# EAGLE design in-out_board (EAGLE 9.2.2)
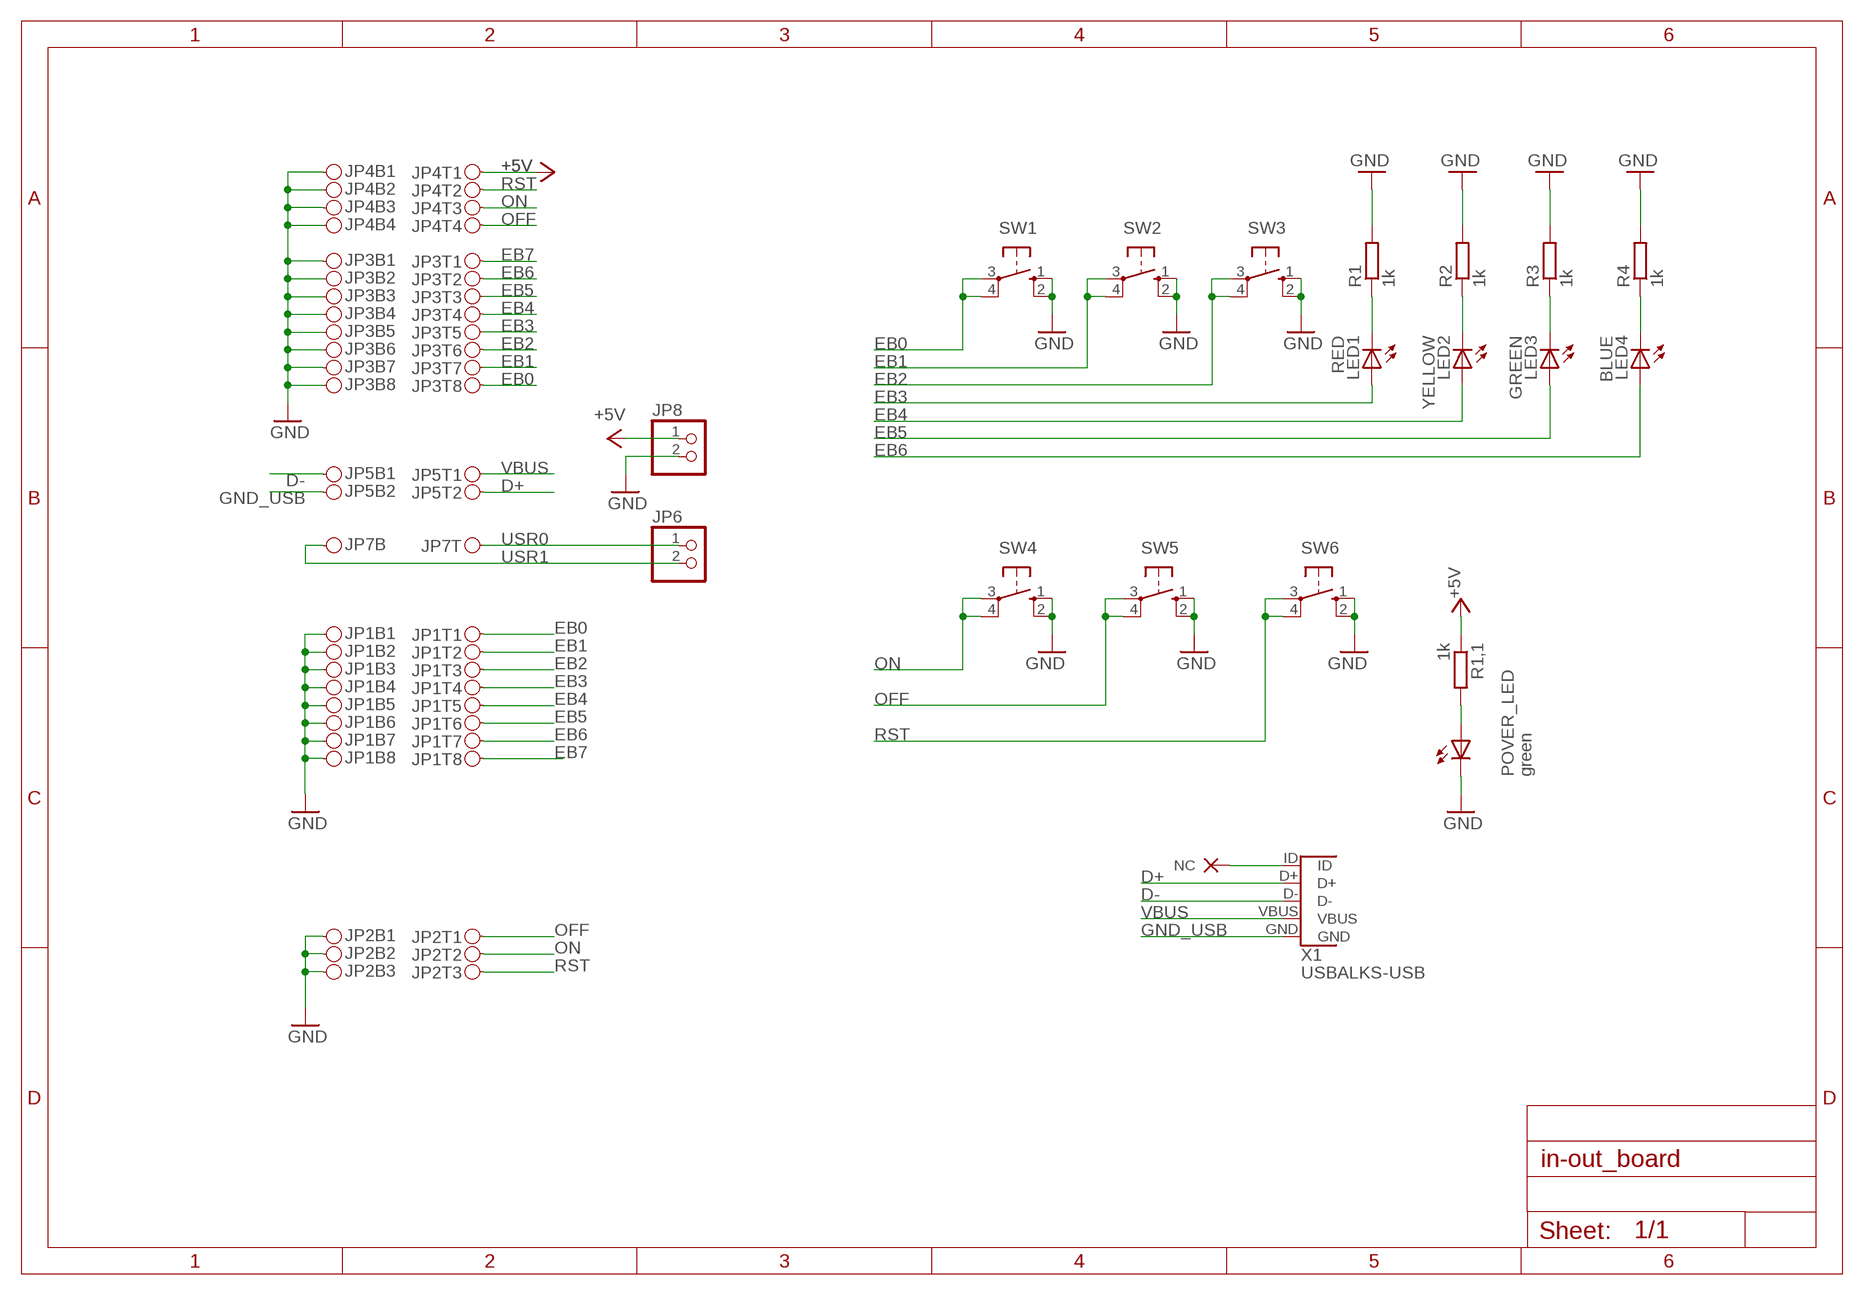
[diagram p0: schematic, sheet 1]

## Parts
JP1  PINH2X08  [PINH2X08SMD]
JP2  PINH2X03  [PINH2X03SMD]
JP3  PINH2X08  [PINH2X08SMD]
JP4  PINH2X04  [PINH2X04SMD]
JP5  PINH2X02  [PINH2X02SMD]
JP6  PINHD-1X2  [1X02]
JP7  PINH2X01  [PINH2X01SMD]
JP8  PINHD-1X2  [1X02]
LED1  RED  LED5MM  [LED5MM]
LED2  YELLOW  LED5MM  [LED5MM]
LED3  GREEN  LED5MM  [LED5MM]
LED4  BLUE  LED5MM  [LED5MM]
NC1  NC  (no package)
POVER_LED  green  LED5MM  [LED5MM]
R1  1k  R-EU_0204/2V  [0204V]
R1,1  1k  R-EU_0204/2V  [0204V]
R2  1k  R-EU_0204/2V  [0204V]
R3  1k  R-EU_0204/2V  [0204V]
R4  1k  R-EU_0204/2V  [0204V]
SW1  10-XX  [B3F-10XX]
SW2  10-XX  [B3F-10XX]
SW3  10-XX  [B3F-10XX]
SW4  10-XX  [B3F-10XX]
SW5  10-XX  [B3F-10XX]
SW6  10-XX  [B3F-10XX]
X1  USBALKS-USB  [ALKS-USB]

## Nets
+5V: JP4.T1 JP8.1 R1,1.1
D+: JP5.T2 X1.D+
D-: JP5.B1 X1.D-
EB0: JP1.T1 JP3.T8 SW1.3(P) SW1.4(P1)
EB1: JP1.T2 JP3.T7 SW2.3(P) SW2.4(P1)
EB2: JP1.T3 JP3.T6 SW3.3(P) SW3.4(P1)
EB3: JP1.T4 JP3.T5 LED1.A
EB4: JP1.T5 JP3.T4 LED2.A
EB5: JP1.T6 JP3.T3 LED3.A
EB6: JP1.T7 JP3.T2 LED4.A
EB7: JP1.T8 JP3.T1
GND: JP1.B1 JP1.B2 JP1.B3 JP1.B4 JP1.B5 JP1.B6 JP1.B7 JP1.B8 JP2.B1 JP2.B2 JP2.B3 JP3.B1 JP3.B2 JP3.B3 JP3.B4 JP3.B5 JP3.B6 JP3.B7 JP3.B8 JP4.B1 JP4.B2 JP4.B3 JP4.B4 JP8.2 POVER_LED.K(C) R1.2 R2.2 R3.2 R4.2 SW1.1(S) SW1.2(S1) SW2.1(S) SW2.2(S1) SW3.1(S) SW3.2(S1) SW4.1(S) SW4.2(S1) SW5.1(S) SW5.2(S1) SW6.1(S) SW6.2(S1)
GND_USB: JP5.B2 X1.GND
LED1: LED1.K(C) R1.1
LED2: LED2.K(C) R2.1
LED3: LED3.K(C) R3.1
LED4: LED4.K(C) R4.1
OFF: JP2.T1 JP4.T4 SW5.3(P) SW5.4(P1)
ON: JP2.T2 JP4.T3 SW4.3(P) SW4.4(P1)
PWRLED: POVER_LED.A R1,1.2
RST: JP2.T3 JP4.T2 SW6.3(P) SW6.4(P1)
USR0: JP6.1 JP7.T1
USR1: JP6.2 JP7.B1
VBUS: JP5.T1 X1.VBUS
X1ID: NC1.NC X1.ID

## Library data of the parts
JP1 JP3 = pinhead_smd:PINH2X08
JP2 = pinhead_smd:PINH2X03
JP4 = pinhead_smd:PINH2X04
JP5 = pinhead_smd:PINH2X02
JP6 JP8 = pinhead:PINHD-1X2: PIN HEADER
JP7 = pinhead_smd:PINH2X01
LED1-LED4 POVER_LED = led:LED: LED OSRAM: - CHIPLED LG R971, LG N971, LY N971, LG Q971, LY Q971, LO R971, LY R971 LH N974, LH R974 LS Q976, LO Q976, LY Q976 LO Q996 - Hyper CHIPLED LW Q18S LB Q993, LB Q99A, LB R99A - SideLED LS A670, LO A670, LY A670, LG A670, LP A670 LB A673, LV A673, LT A673, LW A673 LH A674 LY A675 LS A676, LA A676, LO A676, LY A676, LW A676 LS A679, LY A679, LG A679 - Hyper Micro SIDELED® LS Y876, LA Y876, LO Y876, LY Y876 LT Y87S - SmartLED LW L88C, LW L88S LB L89C, LB L89S, LG L890 LS L89K, LO L89K, LY L89K LS L896, LA L896, LO L896, LY L896 - TOPLED LS T670, LO T670, LY T670, LG T670, LP T670 LSG T670, LSP T670, LSY T670, LOP T670, LYG T670 LG T671, LOG T671, LSG T671 LB T673, LV T673, LT T673, LW T673 LH T674 LS T676, LA T676, LO T676, LY T676, LB T676, LH T676, LSB T676, LW T676 LB T67C, LV T67C, LT T67C, LS T67K, LO T67K, LY T67K, LW E67C LS E67B, LA E67B, LO E67B, LY E67B, LB E67C, LV E67C, LT E67C LW T67C LS T679, LY T679, LG T679 LS T770, LO T770, LY T770, LG T770, LP T770 LB T773, LV T773, LT T773, LW T773 LH T774 LS E675, LA E675, LY E675, LS T675 LS T776, LA T776, LO T776, LY T776, LB T776 LHGB T686 LT T68C, LB T68C - Hyper Mini TOPLED® LB M676 - Mini TOPLED Santana® LG M470 LS M47K, LO M47K, LY M47K Source: http://www.osram.convergy.de LUXEON: - LUMILED® LXK2-PW12-R00, LXK2-PW12-S00, LXK2-PW14-U00, LXK2-PW14-V00 LXK2-PM12-R00, LXK2-PM12-S00, LXK2-PM14-U00 LXK2-PE12-Q00, LXK2-PE12-R00, LXK2-PE12-S00, LXK2-PE14-T00, LXK2-PE14-U00 LXK2-PB12-K00, LXK2-PB12-L00, LXK2-PB12-M00, LXK2-PB14-N00, LXK2-PB14-P00, LXK2-PB14-Q00 LXK2-PR12-L00, LXK2-PR12-M00, LXK2-PR14-Q00, LXK2-PR14-R00 LXK2-PD12-Q00, LXK2-PD12-R00, LXK2-PD12-S00 LXK2-PH12-R00, LXK2-PH12-S00 LXK2-PL12-P00, LXK2-PL12-Q00, LXK2-PL12-R00 Source: www.luxeon.com KINGBRIGHT: KA-3528ASYC Source: www.kingbright.com
NC1 = NC:NC: _EXTERNAL_
R1 R1,1 R2-R4 = resistor:R-EU_: RESISTOR, European symbol
SW1-SW6 = switch-omron:10-XX: OMRON SWITCH; MPN: B3F-1000; OC_FARNELL: 176432; OC_NEWARK: 36M3542
X1 = usb:USB

## Net classes
0 default: width 0.2 mm, drill 0.35 mm, clearance 0.2 mm

## Board
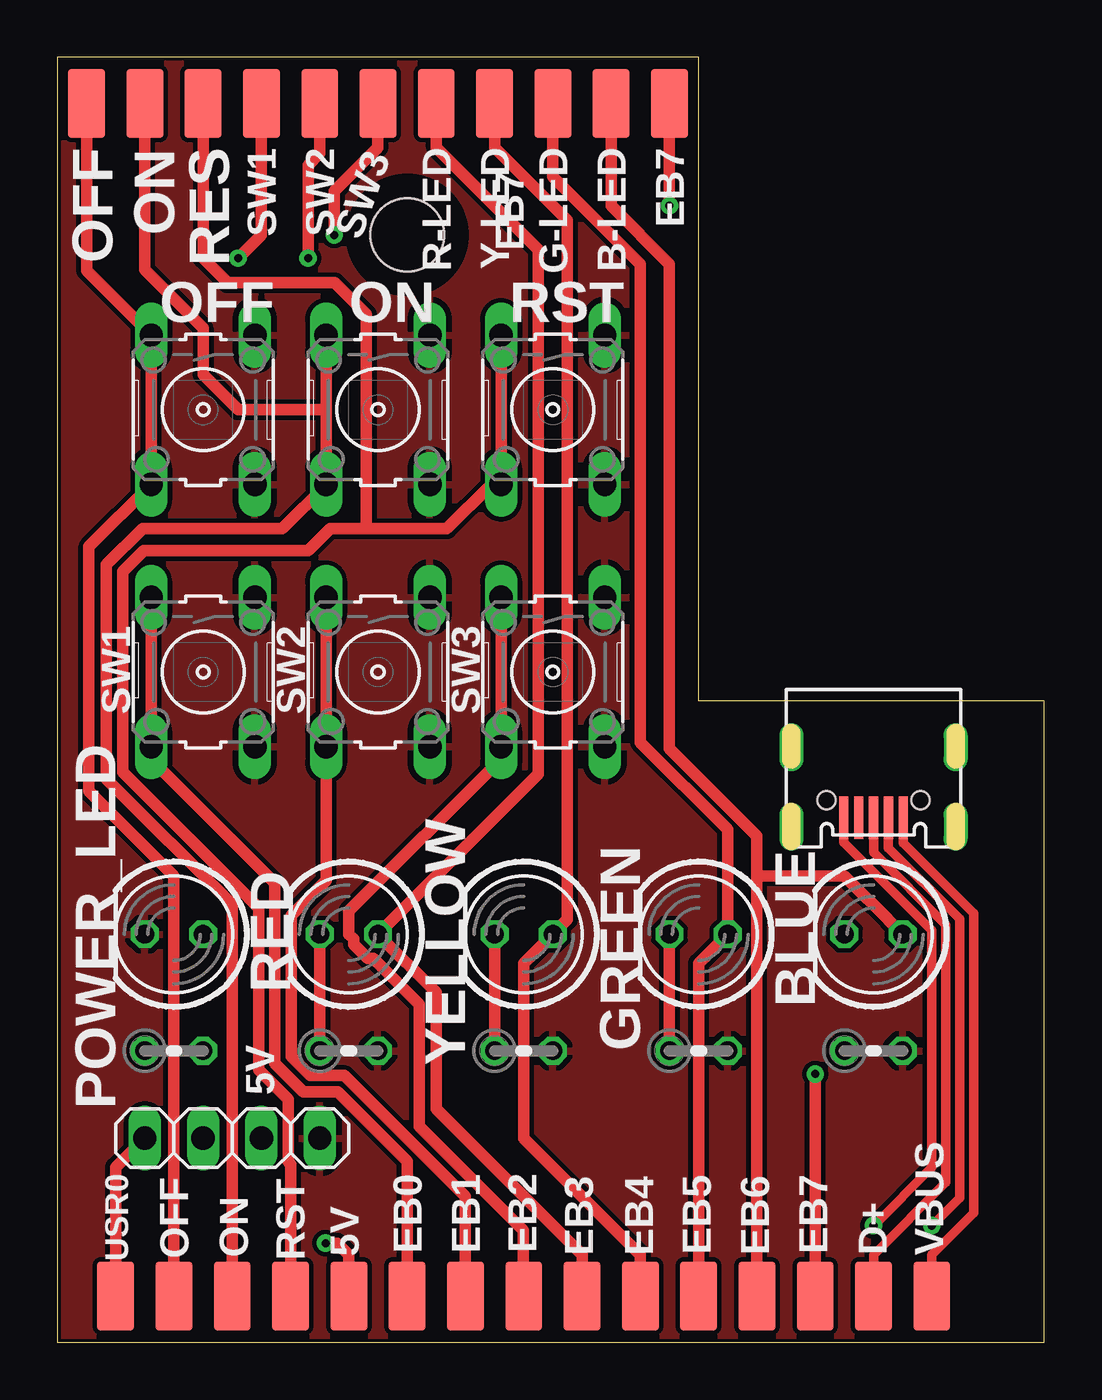
[diagram p1: board, top side]
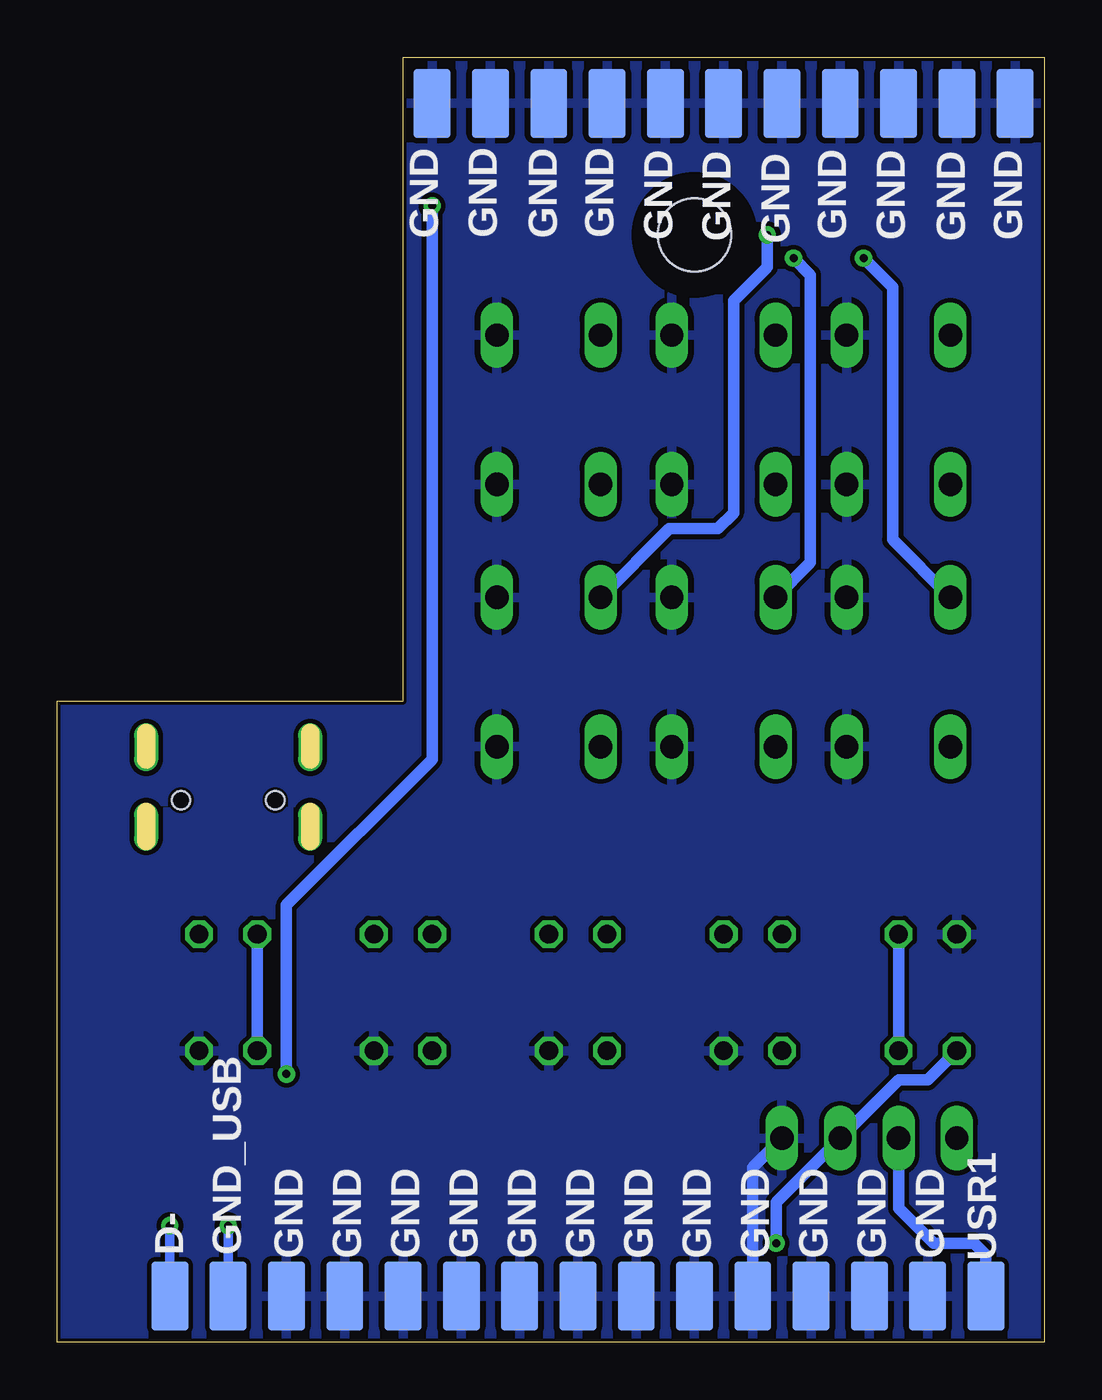
[diagram p2: board, bottom side, seen from below]

Size 43 x 56 mm. Coordinates in mm from the lower left corner, seen from the top.
Outline: 0,0 43,0 43,27.94 27.94,27.94 27.94,56 0,56 0,0
Copper layers (1*16): Top 0.035mm / dielectric 1.5mm / Bottom 0.035mm
Design rules "gatema_2layers *": minimum track width 0.15mm, minimum drill 0.3mm, track to track 0.15mm, track to pad 0.15mm, pad to pad 0.15mm, via to via 0.15mm, smd to smd 0mil, copper to edge 0.15mm, drill to drill 0.4mm, minimum pad ring 0.2mm, minimum via ring 0.2mm, stop-mask expansion 2mil, vias tented up to drill 0.4mm, thermal gap 10mil
Holes 3.2 mm at 15.24,48.26
tRestrict: area 12.6,45.7 to 17.8,50.9
bRestrict: area 12.7,45.7 to 17.8,50.8

### Footprints (pad centres in the part's own frame; a part is rotated, then mirrored left to right if it is on the bottom)
PINH2X08SMD = smd 1.6 x 3 bottom: B1 -8.89,-2; B2 -6.35,-2; B3 -3.81,-2; B4 -1.27,-2; B5 1.27,-2; B6 3.81,-2; B7 6.35,-2; B8 8.89,-2 | smd 1.6 x 3: T1 -8.89,-2; T2 -6.35,-2; T3 -3.81,-2; T4 -1.27,-2; T5 1.27,-2; T6 3.81,-2; T7 6.35,-2; T8 8.89,-2
PINH2X03SMD = smd 1.6 x 3 bottom: B1 -2.54,-2; B2 0,-2; B3 2.54,-2 | smd 1.6 x 3: T1 -2.54,-2; T2 0,-2; T3 2.54,-2
PINH2X04SMD = smd 1.6 x 3 bottom: B1 -3.81,-2; B2 -1.27,-2; B3 1.27,-2; B4 3.81,-2 | smd 1.6 x 3: T1 -3.81,-2; T2 -1.27,-2; T3 1.27,-2; T4 3.81,-2
PINH2X02SMD = smd 1.6 x 3 bottom: B1 -1.27,-2; B2 1.27,-2 | smd 1.6 x 3: T1 -1.27,-2; T2 1.27,-2
1X02 = drill 1.016 long: 1 -1.27,0; 2 1.27,0
PINH2X01SMD = smd 1.6 x 3 bottom: B1 0,-2 | smd 1.6 x 3: T1 0,-2
LED5MM = drill 0.813 octagon: A -1.27,0; K 1.27,0
0204V = drill 0.813 octagon: 1 -1.27,0; 2 1.27,0
B3F-10XX = drill 1.016 long: 1 -3.251,2.261; 2 3.251,2.261; 3 -3.251,-2.261; 4 3.251,-2.261
ALKS-USB = smd 1.85 x 0.4: D+ 5.08,0; D- 5.08,0.65; GND 5.08,-1.3; ID 5.08,-0.65; VBUS 5.08,1.3 | drill 0.65 long: P$6 2.018,-3.575; P$7 2.018,3.575; P$8 5.468,3.575; P$9 5.468,-3.575 | hole 0.8: 4.318,2.05; 4.318,-2.05

### Placement (x,y rotation side)
JP1  17.78,56 0 top
JP2  3.81,56 0 top
JP3  24.13,0 180 top
JP4  8.89,0 180 top
JP5  36.83,0 180 top
JP6  5.08,8.89 0 top
JP7  2.54,0 180 top
JP8  10.16,8.89 0 top
LED1  12.7,17.78 180 top
LED2  20.32,17.78 180 top
LED3  27.94,17.78 180 top
LED4  35.56,17.78 180 top
POVER_LED  5.08,17.78 180 top
R1  12.7,12.7 0 top
R1,1  5.08,12.7 0 top
R2  20.32,12.7 0 top
R3  27.94,12.7 0 top
R4  35.56,12.7 0 top
SW1  6.35,29.21 270 top
SW2  13.97,29.21 270 top
SW3  21.59,29.21 270 top
SW4  13.97,40.64 270 top
SW5  6.35,40.64 270 top
SW6  21.59,40.64 270 top
X1  35.56,27.94 270 top

### Tracks (layer width: path | path; a pad name or v marks a point on that pad's centre or on a via)
+5V  (via drill 0.35)
  Top 0.508: JP4.T1 12.7,3.81 12.19,4.32 v11.68,4.32
  Bottom 0.508: v11.68,4.32 11.68,6.1 JP8.1 6.35,11.43 5.08,11.43 R1,1.1
D+
  Top 0.406: X1.D+ 35.56,21.34 38.71,18.19 38.71,6.96 35.56,3.81 JP5.T2
D-  (via drill 0.35)
  Top 0.406: X1.D- 36.21,21.54 39.31,18.44 39.31,6.29 v38.1,5.08
  Bottom 0.406: v38.1,5.08 JP5.B1
EB0  (via drill 0.35)
  Top 0.508: SW1.3 SW1.4 4.09,25.4 9.48,20.01 9.48,12.15 10.72,10.91 12.22,10.91 15.24,7.89 JP3.T8 | v7.87,47.24 8.89,48.26 JP1.T1
  Bottom 0.508: SW1.3 6.6,34.98 6.6,45.97 v7.87,47.24
EB1  (via drill 0.35)
  Top 0.508: SW2.3 SW2.4 11.71,20.12 10.19,18.59 10.19,12.45 11.01,11.62 12.51,11.62 17.78,6.35 JP3.T7 | JP1.T2 11.43,51.82 10.92,51.31 v10.92,47.24
  Bottom 0.508: SW2.3 10.19,33.98 10.19,46.51 v10.92,47.24
EB2  (via drill 0.35)
  Top 0.508: JP3.T6 20.3,2.02 20.3,4.87 15.76,9.41 15.76,14.72 13.76,16.72 13.53,16.72 12.91,17.34 12.91,17.57 12.7,17.78 12.7,18.8 19.33,25.43 SW3.4 SW3.3 | JP1.T3 13.97,52.07 12.06,50.16 v12.06,48.26
  Bottom 0.508: SW3.3 16.33,35.46 14.22,35.46 13.54,36.15 13.54,45.39 12.06,46.86 v12.06,48.26
EB3
  Top 0.508: JP3.T5 22.86,3.81 16.51,10.16 16.51,15.24 LED1.A 20.95,24.77 20.95,47.62 16.51,52.07 JP1.T4
EB4
  Top 0.508: JP3.T4 25.4,3.81 20.32,8.89 20.32,16.51 LED2.A 22.23,18.41 22.23,48.9 19.05,52.07 JP1.T5
EB5
  Top 0.508: JP3.T3 27.94,16.51 LED3.A 29.21,22.34 25.4,26.15 25.4,46.99 21.59,50.8 JP1.T6
EB6
  Top 0.508: LED4.A 35.56,19.05 35.12,19.49 34.29,20.32 30.48,20.32 | JP1.T7 24.13,49.53 26.67,46.99 26.67,25.88 30.48,22.07 30.48,20.32 | JP3.T2 30.48,20.32
EB7  (via drill 0.35)
  Top 0.508: JP3.T1 v33.02,11.68 | v26.67,49.53 JP1.T8
  Bottom 0.508: v33.02,11.68 33.02,19.05 26.67,25.4 v26.67,49.53
GND
  Bottom 0.508: JP4.B1 12.7,7.62 JP8.2
  pour Top: -5.08,60.96 -5.08,-5.08 50.8,-5.08 50.8,60.96
  pour Bottom: -1.91,58.42 -1.91,-2.54 48.26,-2.54 48.26,58.42
GND_USB  (via drill 0.35)
  Top 0.406: X1.GND 34.26,21.78 38.1,17.94 38.1,7.62 v35.56,5.08
  Bottom 0.406: v35.56,5.08 JP5.B2
LED1
  Top 0.508: LED1.K R1.1
LED2
  Top 0.508: LED2.K R2.1
LED3
  Top 0.508: LED3.K R3.1
LED4
  Bottom 0.508: R4.1 LED4.K
OFF
  Top 0.508: JP2.T1 1.27,46.71 SW5.3 SW5.4 1.37,34.67 1.37,24.03 5.08,20.32 JP4.T4
ON
  Top 0.508: 11.71,40.64 SW4.4 11.71,37.36 9.81,35.46 3.71,35.46 2.13,33.88 2.13,24.55 7.62,19.07 JP4.T3 | 11.71,40.64 SW4.3 | JP2.T2 3.81,46.74 6.35,44.2 6.35,42.16 7.87,40.64 11.71,40.64
PWRLED
  Bottom 0.508: R1,1.2 POVER_LED.A
RST
  Top 0.508: JP2.T3 6.35,47.24 7.42,46.17 12.09,46.17 13.46,44.8 13.46,35.46 | SW6.3 SW6.4 18.89,37.39 16.97,35.46 13.46,35.46 | JP4.T2 10.16,7.74 10.05,7.85 10.05,10.57 8.77,11.86 8.77,18.92 2.85,24.84 2.85,33.58 3.77,34.5 10.92,34.5 11.88,35.46 13.46,35.46
USR0
  Top 0.508: JP7.T1 2.54,7.62 JP6.1
USR1
  Bottom 0.508: JP7.B1 2.54,3.81 3.05,4.32 4.83,4.32 6.35,5.84 JP6.2
VBUS
  Top 0.406: JP5.T1 38.1,3.81 39.92,5.63 39.92,18.69 36.86,21.75 X1.VBUS

### Text on the board
tNames: OFF | ON | RES | SW1 | SW2 | SW3 | R-LED | Y-LED | G-LED | B-LED | EB7 | EB7 | OFF | ON | RST | RED | BLUE | GREEN | YELLOW | 5V | POWER_LED | USR0 | OFF | ON | RST | 5V | EB0 | EB1 | EB2 | EB3 | EB4 | EB5 | EB6 | EB7 | D+ | VBUS
bNames: GND | GND | GND | GND | GND | GND | GND | GND | GND | GND | GND | USR1 | GND | GND | GND | GND | GND | GND | GND | GND | GND | GND | GND | GND | GND | GND_USB | D-